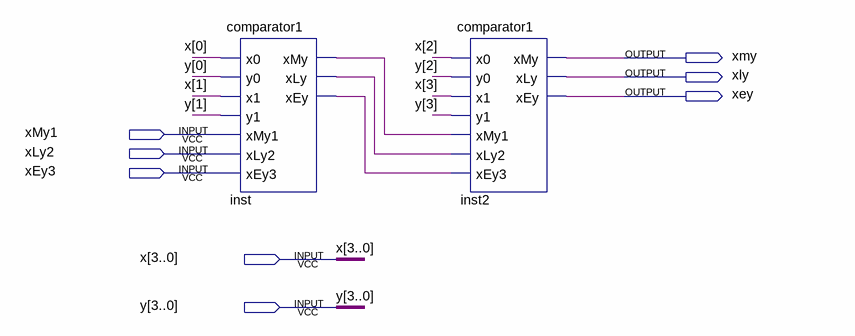
[diagram p0: schematic sheet]
// Quartus schematic cetcomp1.bdf as structural Verilog: 2 symbols, 8 pins
module cetcomp1 (
  input  xMy1,
  input  xLy2,
  input  xEy3,
  input  [3:0] x,
  input  [3:0] y,
  output xmy,
  output xly,
  output xey
);

  wire inst_xey, inst_xly, inst_xmy;

  comparator1 inst (
    .x0(x[0]), .y0(y[0]), .x1(x[1]), .y1(y[1]), .xMy1(xMy1), .xLy2(xLy2), .xEy3(xEy3), .xMy(inst_xmy),
    .xLy(inst_xly), .xEy(inst_xey));
  comparator1 inst2 (
    .x0(x[2]), .y0(y[2]), .x1(x[3]), .y1(y[3]), .xMy1(inst_xmy), .xLy2(inst_xly), .xEy3(inst_xey), .xMy(xmy),
    .xLy(xly), .xEy(xey));
endmodule
